# EAGLE design main (EAGLE 7.6.0)
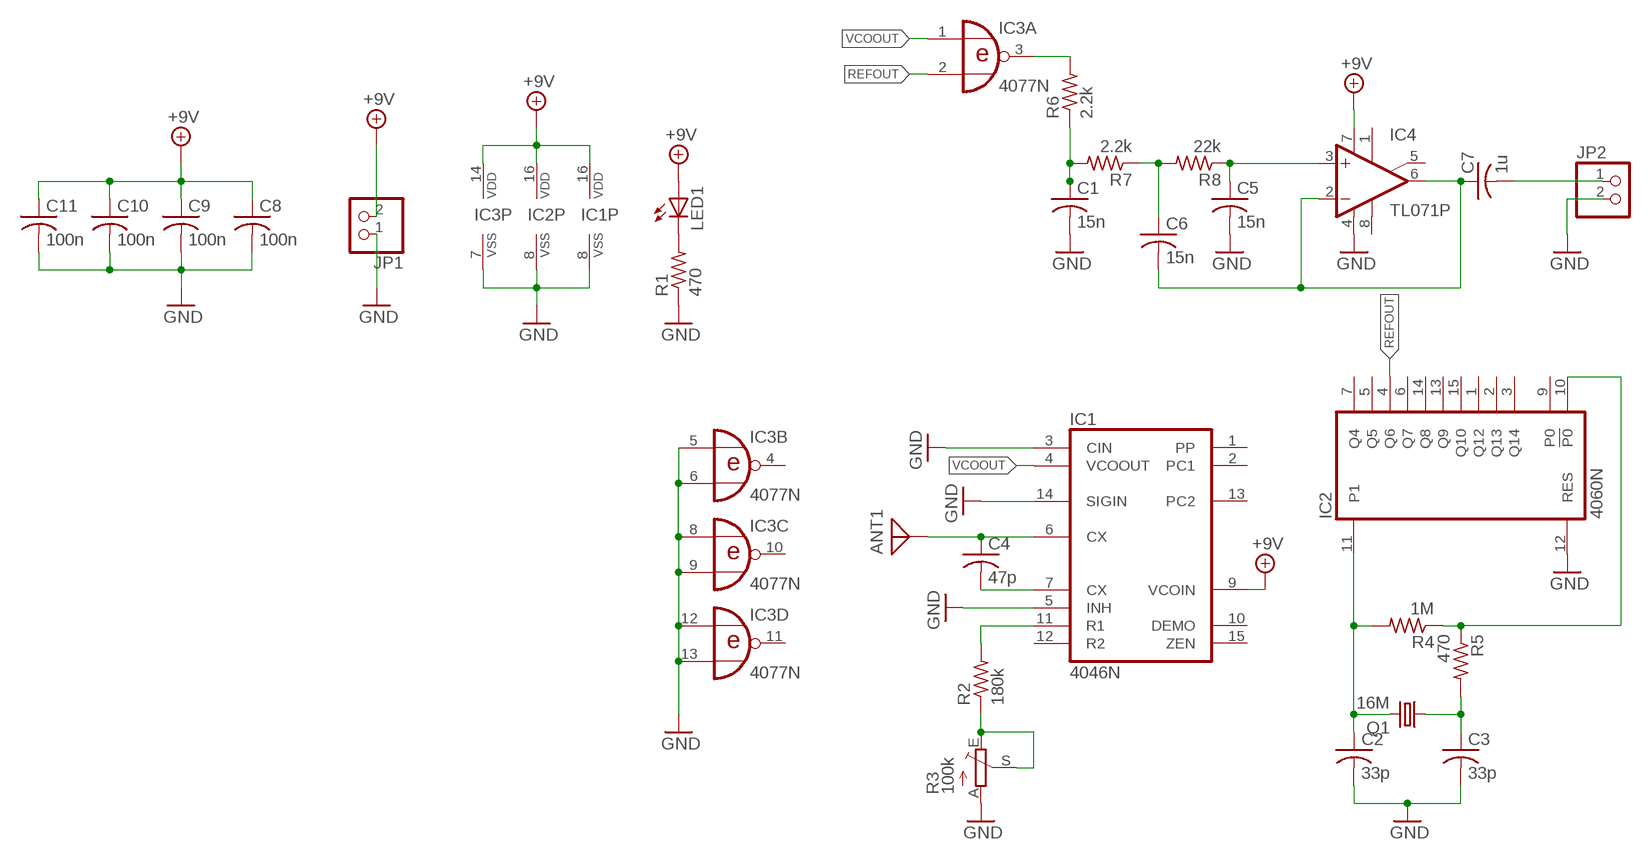
[diagram p0: schematic, sheet 1]

## Parts
ANT1  ANTENNA  [PAD-01]
C1  15n  C-US050-025X075  [C050-025X075]
C2  33p  C-US050-025X075  [C050-025X075]
C3  33p  C-US050-025X075  [C050-025X075]
C4  47p  C-US050-025X075  [C050-025X075]
C5  15n  C-US050-025X075  [C050-025X075]
C6  15n  C-US050-025X075  [C050-025X075]
C7  1u  C-US050-025X075  [C050-025X075]
C8  100n  C-US050-025X075  [C050-025X075]
C9  100n  C-US050-025X075  [C050-025X075]
C10  100n  C-US050-025X075  [C050-025X075]
C11  100n  C-US050-025X075  [C050-025X075]
IC1  4046N  [DIL16]
IC2  4060N  [DIL16]
IC3  4077N  [DIL14]
IC4  TL071P  [DIL08]
JP1  PINHD-1X2  [1X02]
JP2  PINHD-1X2  [1X02]
LED1  LED3MM  [LED3MM]
Q1  16M  CRYSTALHC49S  [HC49/S]
R1  470  R-US_0204/7  [0204/7]
R2  180k  R-US_0207/10  [0207/10]
R3  100k  TRIM_EU-RJ9W  [RJ9W]
R4  1M  R-US_0204/7  [0204/7]
R5  470  R-US_0204/7  [0204/7]
R6  2.2k  R-US_0204/7  [0204/7]
R7  2.2k  R-US_0204/7  [0204/7]
R8  22k  R-US_0204/7  [0204/7]

## Nets
+9V: C8.1 C9.1 C10.1 C11.1 IC1.9(VCOIN) IC1.16(VDD) IC2.16(VDD) IC3.14(P:VDD) IC4.7(V+) JP1.2 LED1.A
GND: C1.2 C2.2 C3.2 C5.2 C8.2 C9.2 C10.2 C11.2 IC1.3(CIN) IC1.5(INH) IC1.8(VSS) IC1.14(SIGIN) IC2.8(VSS) IC2.12(RES) IC3.5(B:I0) IC3.6(B:I1) IC3.7(P:VSS) IC3.8(C:I0) IC3.9(C:I1) IC3.12(D:I0) IC3.13(D:I1) IC4.4(V-) JP1.1 JP2.2 R1.1 R3.A
N$1: IC2.10(!P0) R4.1 R5.1
N$2: LED1.K(C) R1.2
N$3: C2.1 IC2.11(P1) Q1.2 R4.2
N$4: C3.1 Q1.1 R5.2
N$5: C6.1 R7.1 R8.2
N$6: IC1.11(R1) R2.2
N$7: R2.1 R3.E R3.S
N$8: C4.2 IC1.7(CX)
N$9: ANT1.1 C4.1 IC1.6(CX)
N$10: C1.1 R6.1 R7.2
N$11: IC3.3(A:O) R6.2
N$12: C5.1 IC4.3(+IN) R8.1
N$13: C6.2 C7.1 IC4.2(-IN) IC4.6(OUT)
N$18: C7.2 JP2.1
REFOUT: IC2.4(Q6) IC3.2(A:I1)
VCOOUT: IC1.4(VCOOUT) IC3.1(A:I0)
Unconnected: IC1.1(PP) IC1.2(PC1) IC1.10(DEMO) IC1.12(R2) IC1.13(PC2) IC1.15(ZEN) IC2.1(Q12) IC2.2(Q13) IC2.3(Q14) IC2.5(Q5) IC2.6(Q7) IC2.7(Q4) IC2.9(P0) IC2.13(Q9) IC2.14(Q8) IC2.15(Q10) IC3.4(B:O) IC3.10(C:O) IC3.11(D:O) IC4.1(ON1) IC4.5(ON2) IC4.8(OPT)

## Library data of the parts
ANT1 = discrete:ANTENNA: Antenna
C1-C11 = adafruit:C-US: CAPACITOR, American symbol
IC1 = 40xx:4046: Micropower PLL
IC2 = 40xx:4060: 14-stage binary/ripple COUNTER
IC3 = 40xx:4077: Quad XNOR
IC4 = linear:TL071: OP AMP
JP1 JP2 = pinhead:PINHD-1X2: PIN HEADER
LED1 = adafruit:LED: LED OSRAM: - CHIPLED LG R971, LG N971, LY N971, LG Q971, LY Q971, LO R971, LY R971 LH N974, LH R974 LS Q976, LO Q976, LY Q976 LO Q996 - Hyper CHIPLED LW Q18S LB Q993, LB Q99A, LB R99A - SideLED LS A670, LO A670, LY A670, LG A670, LP A670 LB A673, LV A673, LT A673, LW A673 LH A674 LY A675 LS A676, LA A676, LO A676, LY A676, LW A676 LS A679, LY A679, LG A679 - Hyper Micro SIDELED® LS Y876, LA Y876, LO Y876, LY Y876 LT Y87S - SmartLED LW L88C, LW L88S LB L89C, LB L89S, LG L890 LS L89K, LO L89K, LY L89K LS L896, LA L896, LO L896, LY L896 - TOPLED LS T670, LO T670, LY T670, LG T670, LP T670 LSG T670, LSP T670, LSY T670, LOP T670, LYG T670 LG T671, LOG T671, LSG T671 LB T673, LV T673, LT T673, LW T673 LH T674 LS T676, LA T676, LO T676, LY T676, LB T676, LH T676, LSB T676, LW T676 LB T67C, LV T67C, LT T67C, LS T67K, LO T67K, LY T67K, LW E67C LS E67B, LA E67B, LO E67B, LY E67B, LB E67C, LV E67C, LT E67C LW T67C LS T679, LY T679, LG T679 LS T770, LO T770, LY T770, LG T770, LP T770 LB T773, LV T773, LT T773, LW T773 LH T774 LS E675, LA E675, LY E675, LS T675 LS T776, LA T776, LO T776, LY T776, LB T776 LHGB T686 LT T68C, LB T68C - Hyper Mini TOPLED® LB M676 - Mini TOPLED Santana® LG M470 LS M47K, LO M47K, LY M47K Source: http://www.osram.convergy.de/
Q1 = crystal:CRYSTAL: CRYSTAL; OC_FARNELL: 1667008; OC_NEWARK: unknown
R1 R2 R4-R8 = adafruit:R-US_: RESISTOR, American symbol
R3 = pot:TRIM_EU-: POTENTIOMETER

## Board
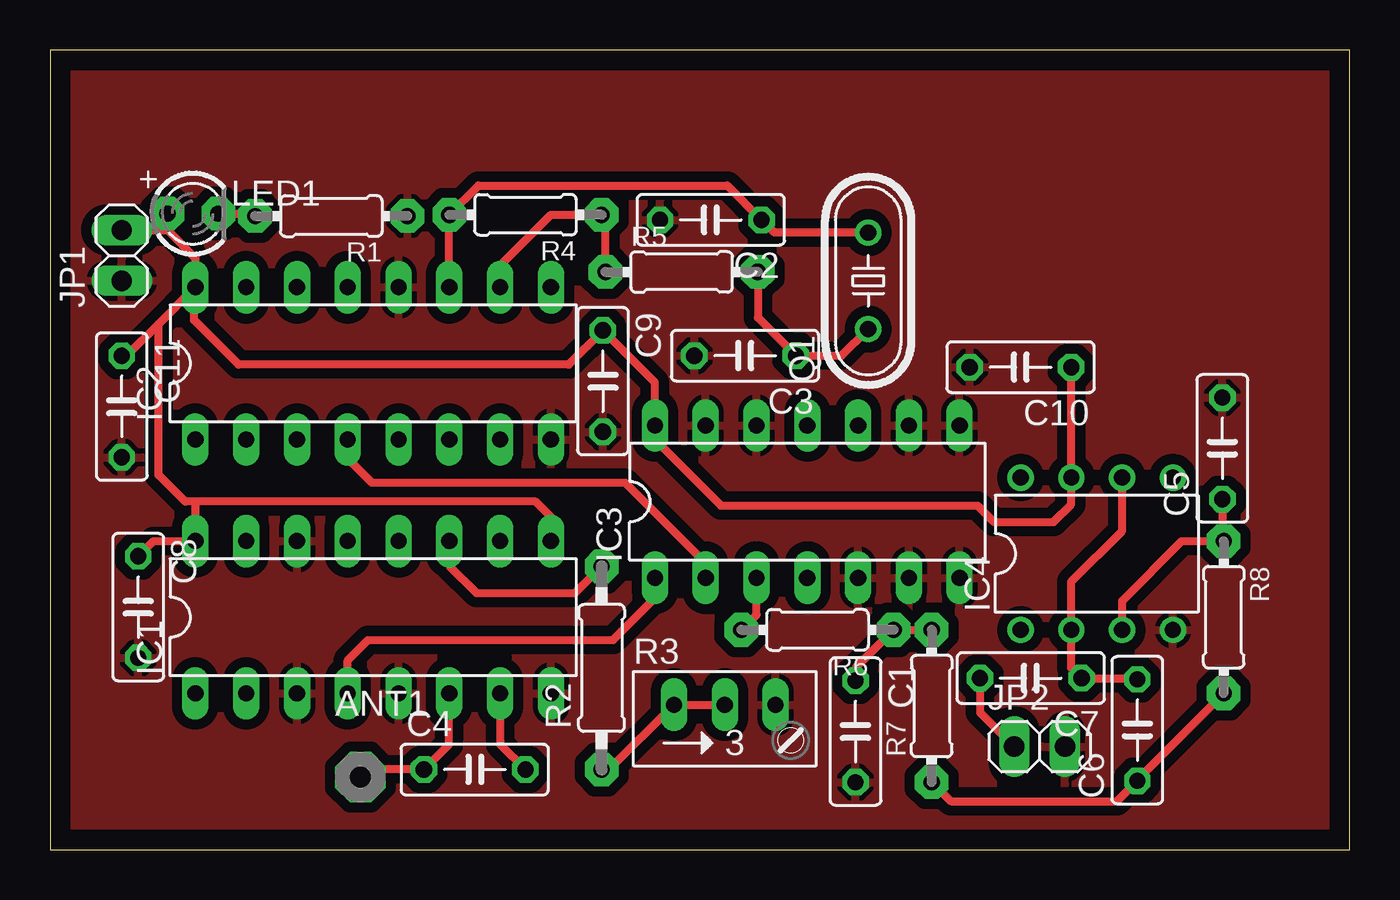
[diagram p1: board, top side]

Size 65 x 40 mm. Coordinates in mm from the lower left corner, seen from the top.
Outline: 0,0 65,0 65,40 0,40 0,0
Copper layers (1*16): Top 0.035mm / dielectric 1.5mm / Bottom 0.035mm
Design rules "default": minimum track width 10mil, minimum drill 24mil, track to track 8mil, track to pad 8mil, pad to pad 8mil, via to via 8mil, smd to smd 8mil, copper to edge 40mil, drill to drill 8mil, minimum pad ring 10mil, minimum via ring 8mil, stop-mask expansion 4mil, vias tented up to drill 0mil, thermal gap 10mil

### Footprints (pad centres in the part's own frame; a part is rotated, then mirrored left to right if it is on the bottom)
PAD-01 = drill 1.321 pad 2.54 octagon: 1 0,0
C050-025X075 = drill 0.813 octagon: 1 -2.54,0; 2 2.54,0
DIL16 = drill 0.813 long: 1 -8.89,-3.81; 2 -6.35,-3.81; 3 -3.81,-3.81; 4 -1.27,-3.81; 5 1.27,-3.81; 6 3.81,-3.81; 7 6.35,-3.81; 8 8.89,-3.81; 9 8.89,3.81; 10 6.35,3.81; 11 3.81,3.81; 12 1.27,3.81; 13 -1.27,3.81; 14 -3.81,3.81; 15 -6.35,3.81; 16 -8.89,3.81
DIL14 = drill 0.813 long: 1 -7.62,-3.81; 2 -5.08,-3.81; 3 -2.54,-3.81; 4 0,-3.81; 5 2.54,-3.81; 6 5.08,-3.81; 7 7.62,-3.81; 8 7.62,3.81; 9 5.08,3.81; 10 2.54,3.81; 11 0,3.81; 12 -2.54,3.81; 13 -5.08,3.81; 14 -7.62,3.81
DIL08 = drill 0.813 pad 1.27: 1 -3.81,-3.81; 2 -1.27,-3.81; 3 1.27,-3.81; 4 3.81,-3.81; 5 3.81,3.81; 6 1.27,3.81; 7 -1.27,3.81; 8 -3.81,3.81
1X02 = drill 1.016 long: 1 -1.27,0; 2 1.27,0
LED3MM = drill 0.813 pad 1.676 octagon: A -1.27,0; K 1.27,0
HC49/S = drill 0.813: 1 -2.413,0; 2 2.413,0
0204/7 = drill 0.813 pad 1.676 octagon: 1 -3.81,0; 2 3.81,0
0207/10 = drill 0.813 pad 1.676 octagon: 1 -5.08,0; 2 5.08,0
RJ9W = drill 0.813 long: A 2.54,0.635; E -2.54,0.635; S 0,0.635

### Placement (x,y rotation side)
ANT1  15.53,3.62 0 top
C1  40.29,5.91 270 top
C2  33.05,31.5 180 top
C3  34.77,24.7 180 top
C4  21.24,4 0 top
C5  58.64,20.07 90 top
C6  54.39,5.97 90 top
C7  49.05,8.57 180 top
C8  4.41,12.13 270 top
C9  27.66,23.43 270 top
C10  48.54,24.13 180 top
C11  3.59,22.16 270 top
IC1  16.16,11.62 0 top
IC2  16.16,24.32 0 top
IC3  37.88,17.4 0 top
IC4  52.36,14.8 0 top
JP1  3.59,29.72 90 top
JP2  49.5,5.15 0 top
LED1  7.14,31.82 0 top
Q1  40.93,28.45 90 top
R1  14.07,31.69 180 top
R2  27.59,9.08 90 top
R3  33.75,6.61 0 top
R4  23.78,31.75 180 top
R5  31.59,28.89 0 top
R6  38.39,10.99 180 top
R7  44.1,7.18 90 top
R8  58.71,11.62 270 top

### Tracks (layer width: path | path; a pad name or v marks a point on that pad's centre or on a via)
+9V
  Top 0.406: IC1.9 25.05,16.64 24.29,17.4 7.27,17.4 | 7.27,17.4 IC1.16 5.18,15.43 C8.1 | 7.27,17.4 6.76,17.4 5.43,18.73 5.43,26.29 | 5.43,26.29 IC2.16 | IC2.16 7.21,28.07 7.21,26.48 9.43,24.26 25.94,24.26 C9.1 30.26,23.37 IC3.14 30.26,20.51 33.56,17.21 46.39,17.21 47.21,16.39 50.2,16.39 51.09,17.27 IC4.7 51.09,20.77 C10.1 | 6.32,27.18 IC2.16 | C11.1 3.84,24.7 5.43,26.29 | JP1.2 5.88,30.99 | 5.88,30.99 7.27,29.59 IC2.16 | LED1.A 5.88,30.99
GND
  pour Top (isolate 0.508): -4.32,78.74 100.33,78.74 100.33,0 -4.32,0
N$1
  Top 0.406: R5.1 27.78,31.56 R4.1 25.05,31.75 22.51,29.21 IC2.10
N$2
  Top 0.406: LED1.K 10.13,31.82 R1.2
N$3
  Top 0.406: IC2.11 R4.2 21.43,33.21 33.88,33.21 C2.1 36.23,30.86 Q1.2
N$4
  Top 0.406: R5.2 35.4,26.61 C3.1 39.59,24.7 Q1.1
N$5
  Top 0.406: R7.1 45.05,2.42 53.37,2.42 C6.1 54.39,3.5 R8.2
N$6
  Top 0.406: IC1.11 19.97,14.19 21.34,12.83 26.26,12.83 R2.2
N$7
  Top 0.406: R3.S R3.E 27.97,4 R2.1
N$8
  Top 0.406: IC1.7 22.51,5.27 C4.2
N$9
  Top 0.406: IC1.6 19.97,5.27 C4.1 15.91,4 ANT1.1
N$10
  Top 0.406: C1.1 40.29,9.08 R6.1 R7.2
N$11
  Top 0.406: R6.2 35.34,11.75 IC3.3
N$12
  Top 0.406: IC4.3 53.63,12.45 56.61,15.43 R8.1 C5.1
N$13
  Top 0.406: IC4.6 53.63,15.94 51.09,13.4 IC4.2 51.09,9.08 C7.1 54.33,8.57 C6.2
N$18
  Top 0.406: C7.2 46.52,6.86 JP2.1
REFOUT
  Top 0.406: IC2.4 14.89,19.56 16.1,18.35 28.76,18.35 32.77,14.35 32.77,13.62 IC3.2
VCOOUT
  Top 0.406: IC1.4 14.89,9.46 15.91,10.48 28.16,10.48 30.26,12.57 IC3.1